# EAGLE schematic TestMule 2015 (EAGLE 7.2.0)
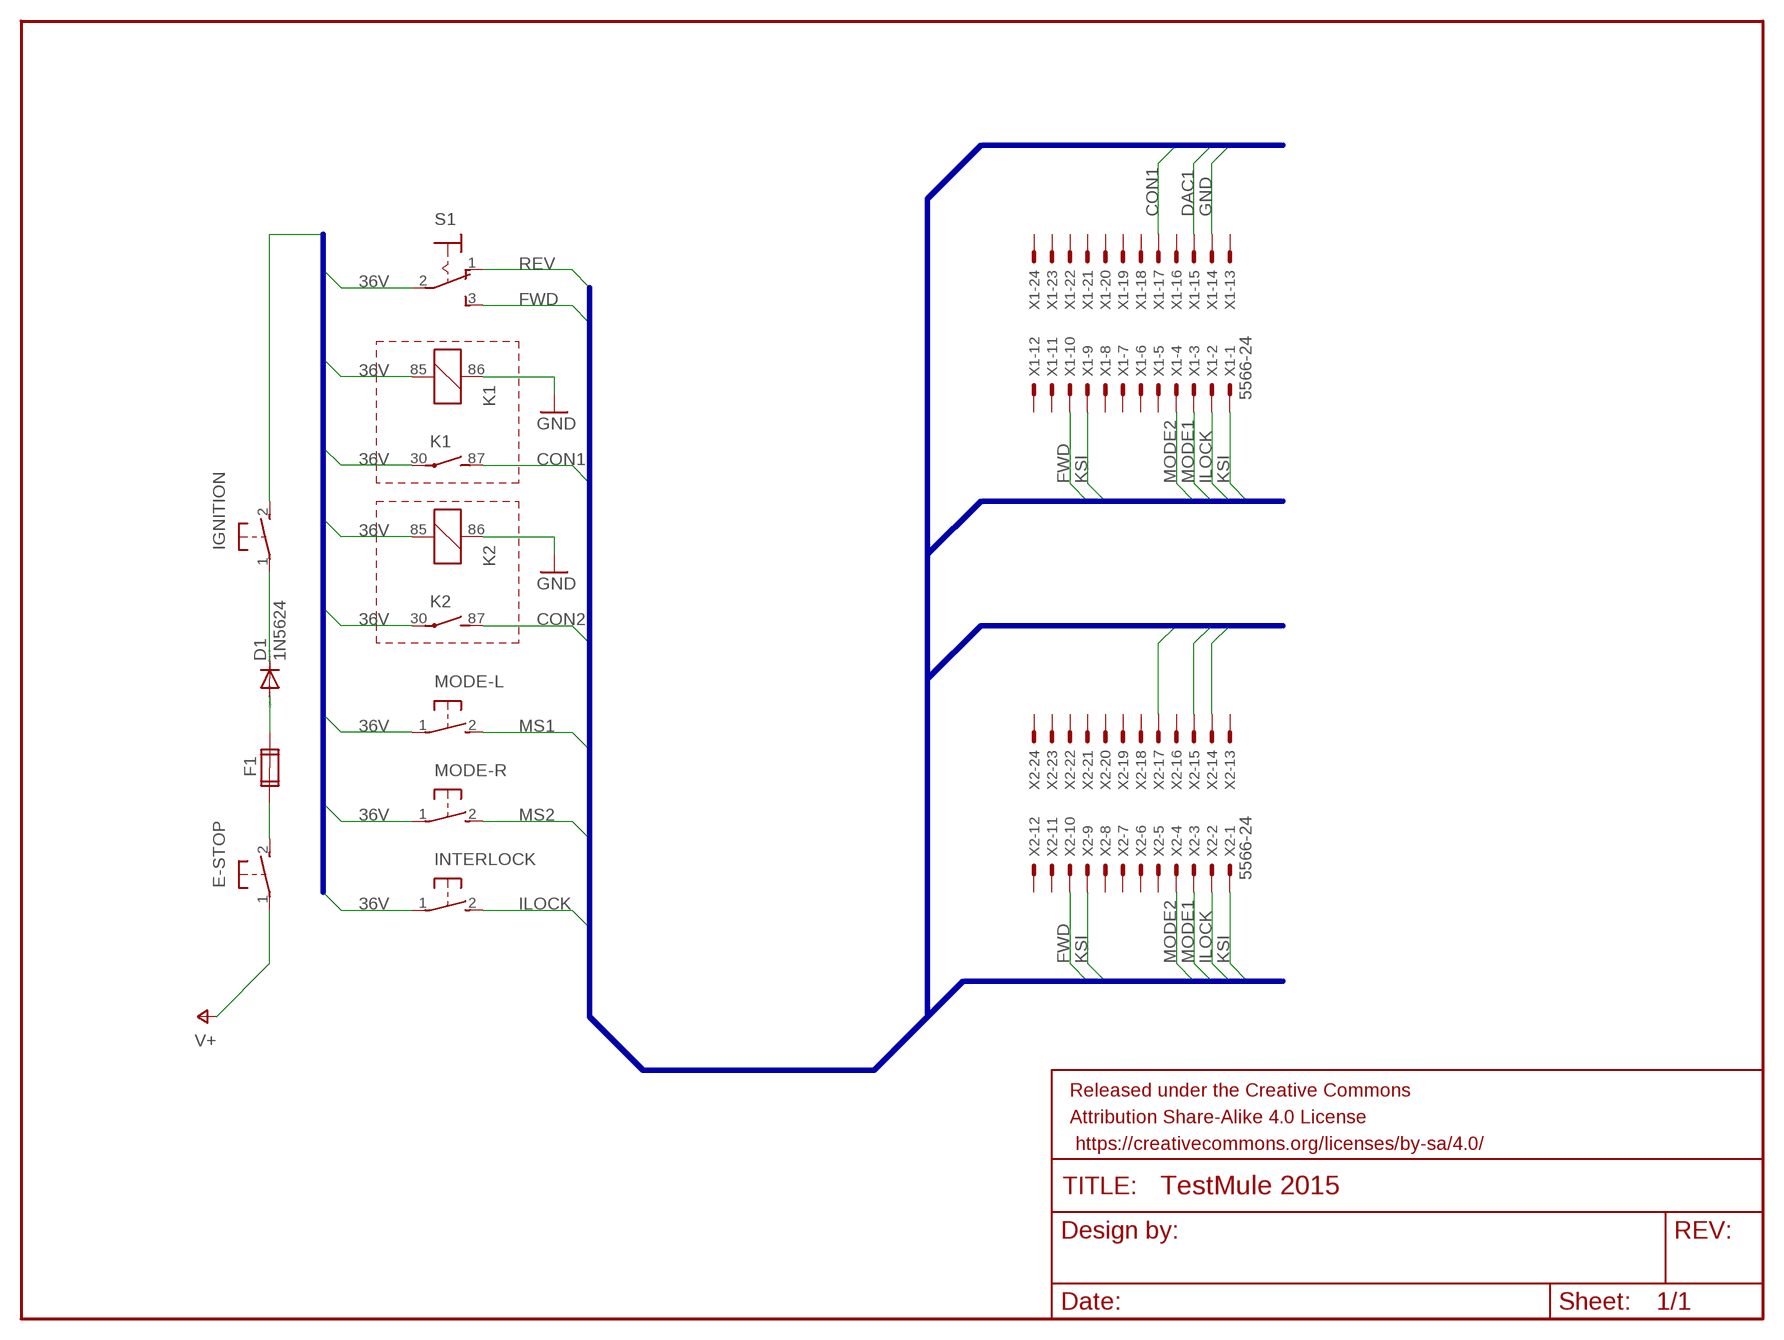
[diagram p0: schematic, sheet 1]

## Parts
D1  1N5624  [DO201-15]
E-STOP  31-XX  [B3F-31XX]
F1  FUSE2P  [FUSE1]
FRAME1  FRAME-LETTER  [CREATIVE_COMMONS]
IGNITION  31-XX  [B3F-31XX]
INTERLOCK  31-XX  [B3F-31XX]
K1  CB1A-P-12V  [CB1]
K2  CB1A-P-12V  [CB1]
MODE-L  31-XX  [B3F-31XX]
MODE-R  31-XX  [B3F-31XX]
S1  320-916  [320-916]
X1  5566-24  [5566-24]
X2  5566-24  [5566-24]

## Nets
36V: IGNITION.2(S) INTERLOCK.1(P) K1.30(2:P) K1.85 K2.30(2:P) K2.85 MODE-L.1(P) MODE-R.1(P) S1.2(P)
CON1: K1.87(2:S) X1.17 X2.17
CON2: K2.87(2:S)
DAC1: X1.15
DAC2: X2.15
FWD: S1.3(S) X1.10 X2.10
GND: K1.86 K2.86 X1.14 X2.14
ILOCK: INTERLOCK.2(S) X1.2 X2.2
KSI: X1.1 X1.9 X2.1 X2.9
MODE1: X1.3 X2.3
MODE2: X1.4 X2.4
MS1: MODE-L.2(S)
MS2: MODE-R.2(S)
N$1: D1.A F1.2A
N$2: E-STOP.2(S) F1.1A
N$3: D1.C IGNITION.1(P)
REV: S1.1(O)
V+: E-STOP.1(P)
Unconnected: F1.1B F1.2B X1.5 X1.6 X1.7 X1.8 X1.11 X1.12 X1.13 X1.16 X1.18 X1.19 X1.20 X1.21 X1.22 X1.23 X1.24 X2.5 X2.6 X2.7 X2.8 X2.11 X2.12 X2.13 X2.16 X2.18 X2.19 X2.20 X2.21 X2.22 X2.23 X2.24

## Buses
36V
REV,FWD,CON[1..2],MODE[1..2],ILOCK,GND,KSI,DAC[1..2]

## Library data of the parts
D1 = diode:1N5624: DIODE controlled avalanche rectifier
E-STOP IGNITION INTERLOCK MODE-L MODE-R = adafruit:31-XX: OMRON SWITCH Now with beefier pads!
F1 = special:FUSE2P: FUSE 5 x 20 mm
FRAME1 = SparkFun-Aesthetics:FRAME-LETTER: Schematic Frame Standard 8.5x11 US Letter frame
K1 K2 = relay:CB*: HIGH POWER AUTOMOTIVE RELAY Form A NAiS Source: http://www.mew-europe.com/.. en_ds_61202_0000.pdf; MF: AROMAT/ MATSUSHITA; MPN: CB1A-P-12V; OC_FARNELL: 1270582; OC_NEWARK: 50B849
S1 = switch:320-916: TOGGLE SWITCH distributor RS Components
X1 X2 = con-molex:5566-24: Mini FIT connector 24 pol Source: http://www.molex.com; OC_FARNELL: unknown; OC_NEWARK: unknown